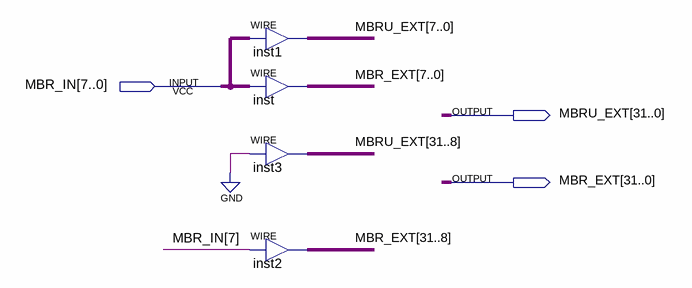
[diagram p0: schematic sheet]
// Quartus schematic mbr_extender.bdf as structural Verilog: 4 symbols, 3 pins
module mbr_extender (
  input  [7:0] MBR_IN,
  output [31:0] MBRU_EXT,
  output [31:0] MBR_EXT
);

  assign MBRU_EXT[7:0] = MBR_IN;  // WIRE inst1
  assign MBR_EXT[7:0] = MBR_IN;  // WIRE inst
  assign MBRU_EXT[31:8] = {24{1'b0}};  // WIRE inst3
  assign MBR_EXT[31:8] = {24{MBR_IN[7]}};  // WIRE inst2
endmodule
